# EAGLE schematic sanguish 3 (EAGLE 6.2)
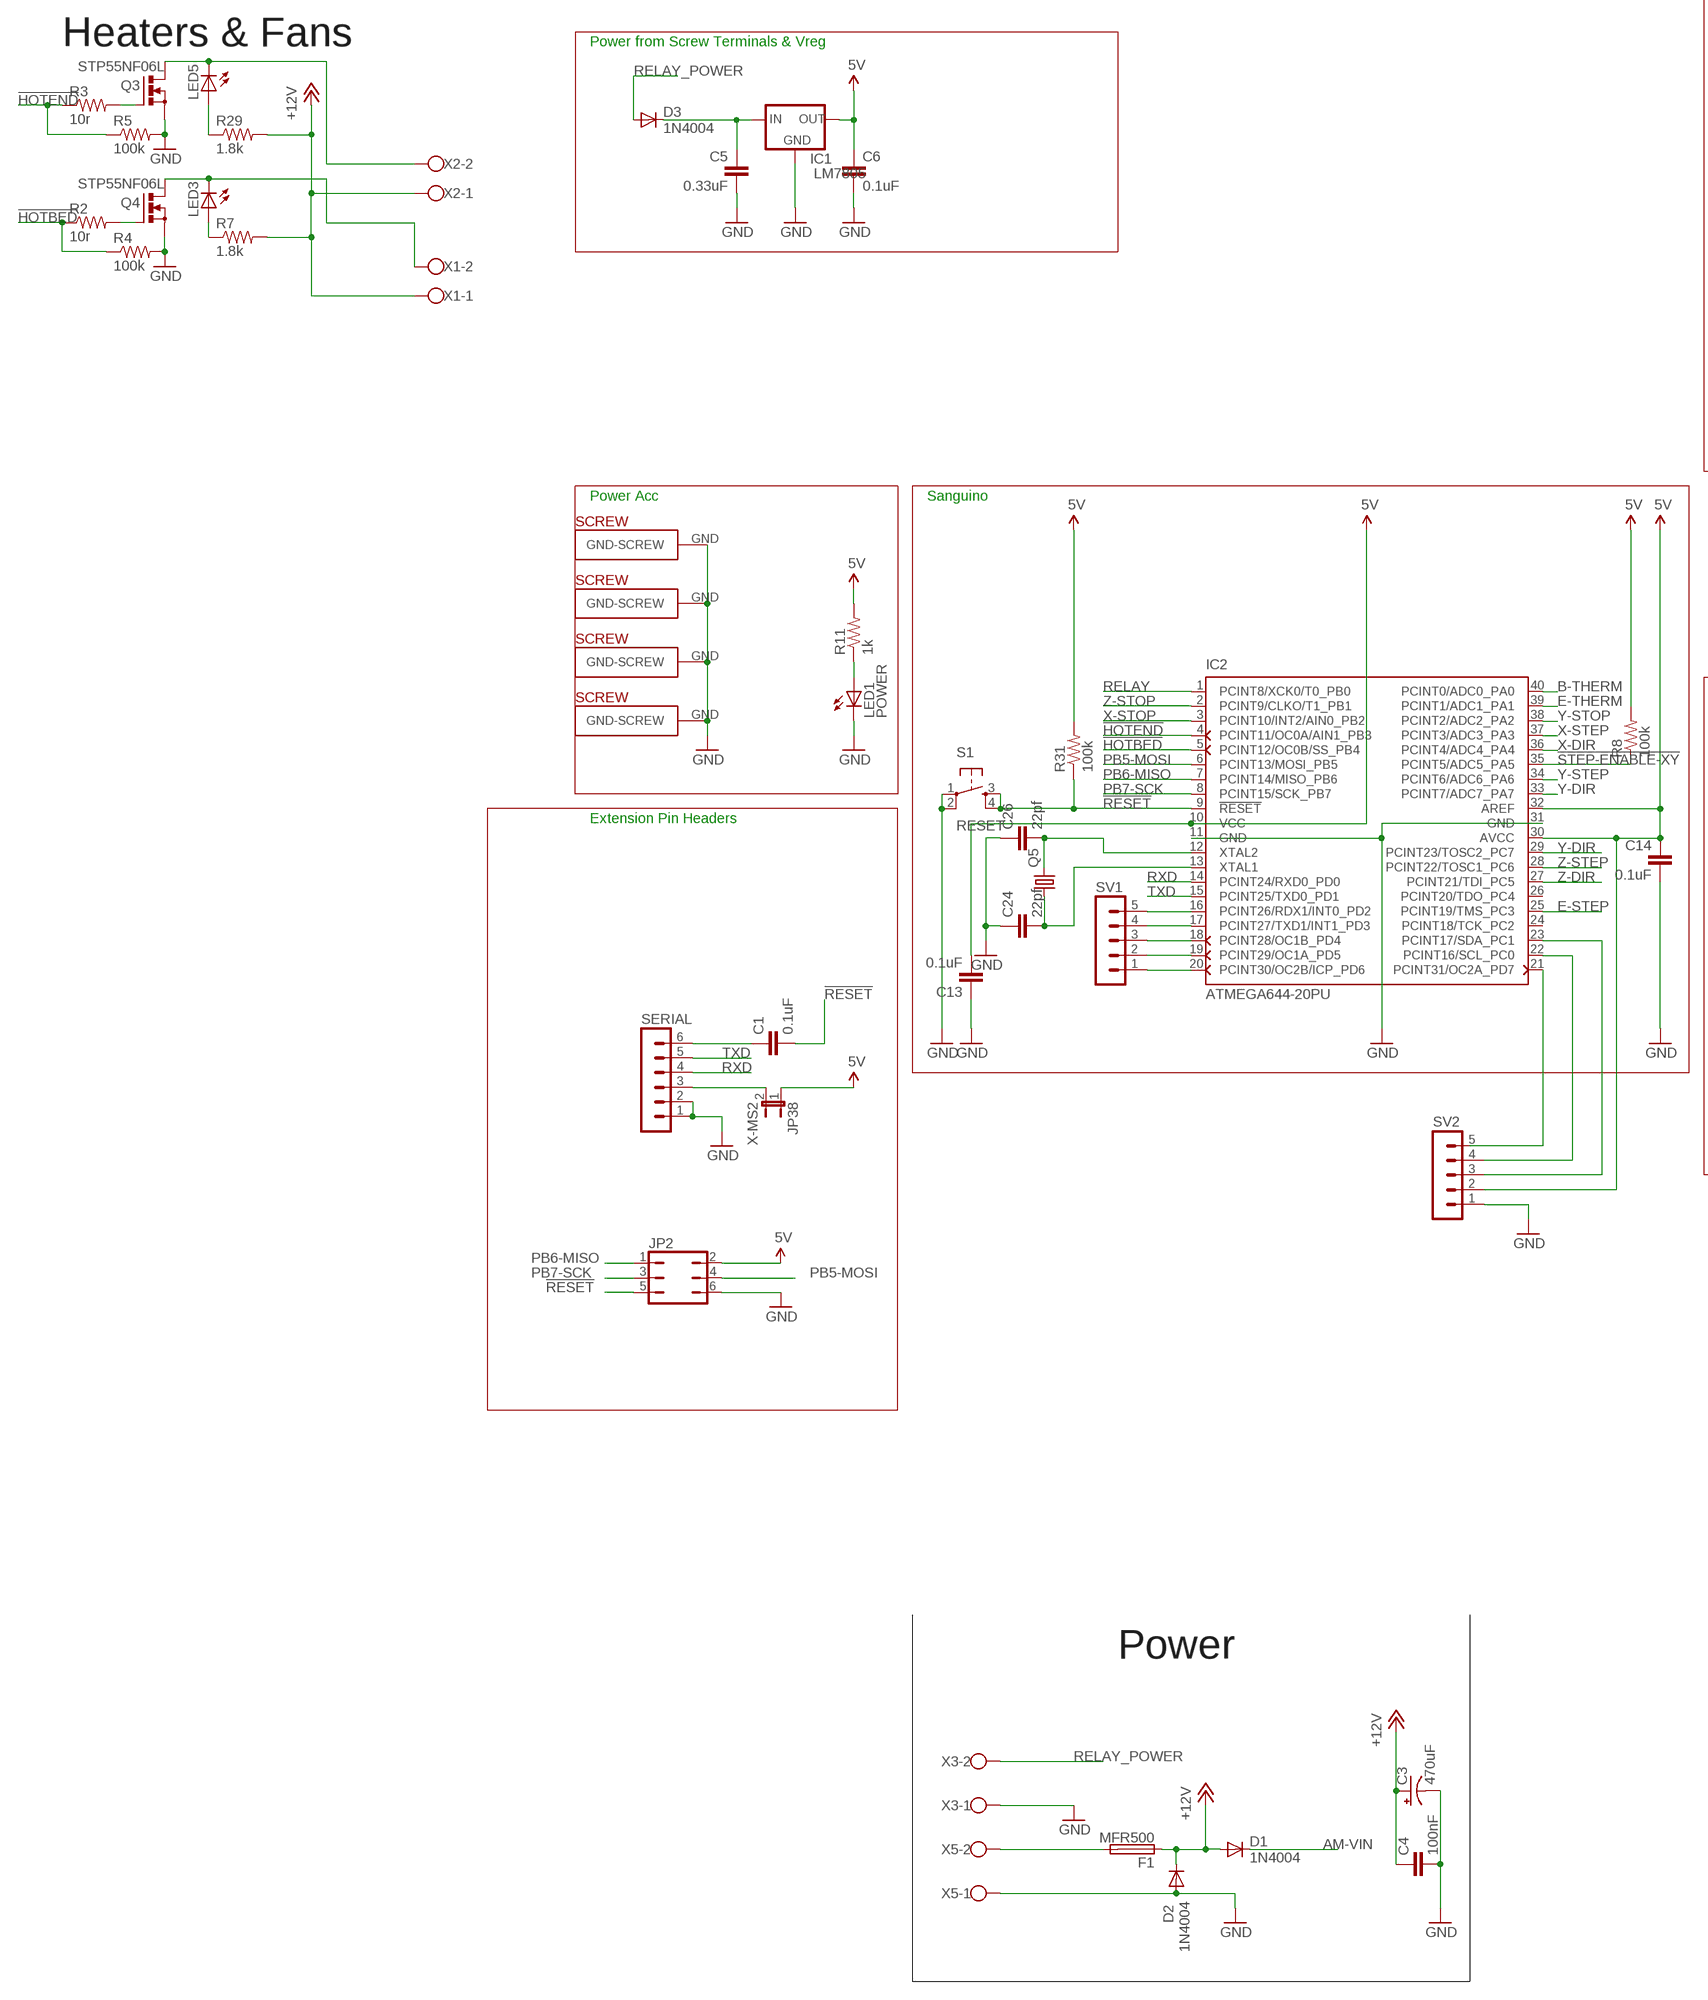
[diagram p0: schematic, sheet 1, part 1 of 2]
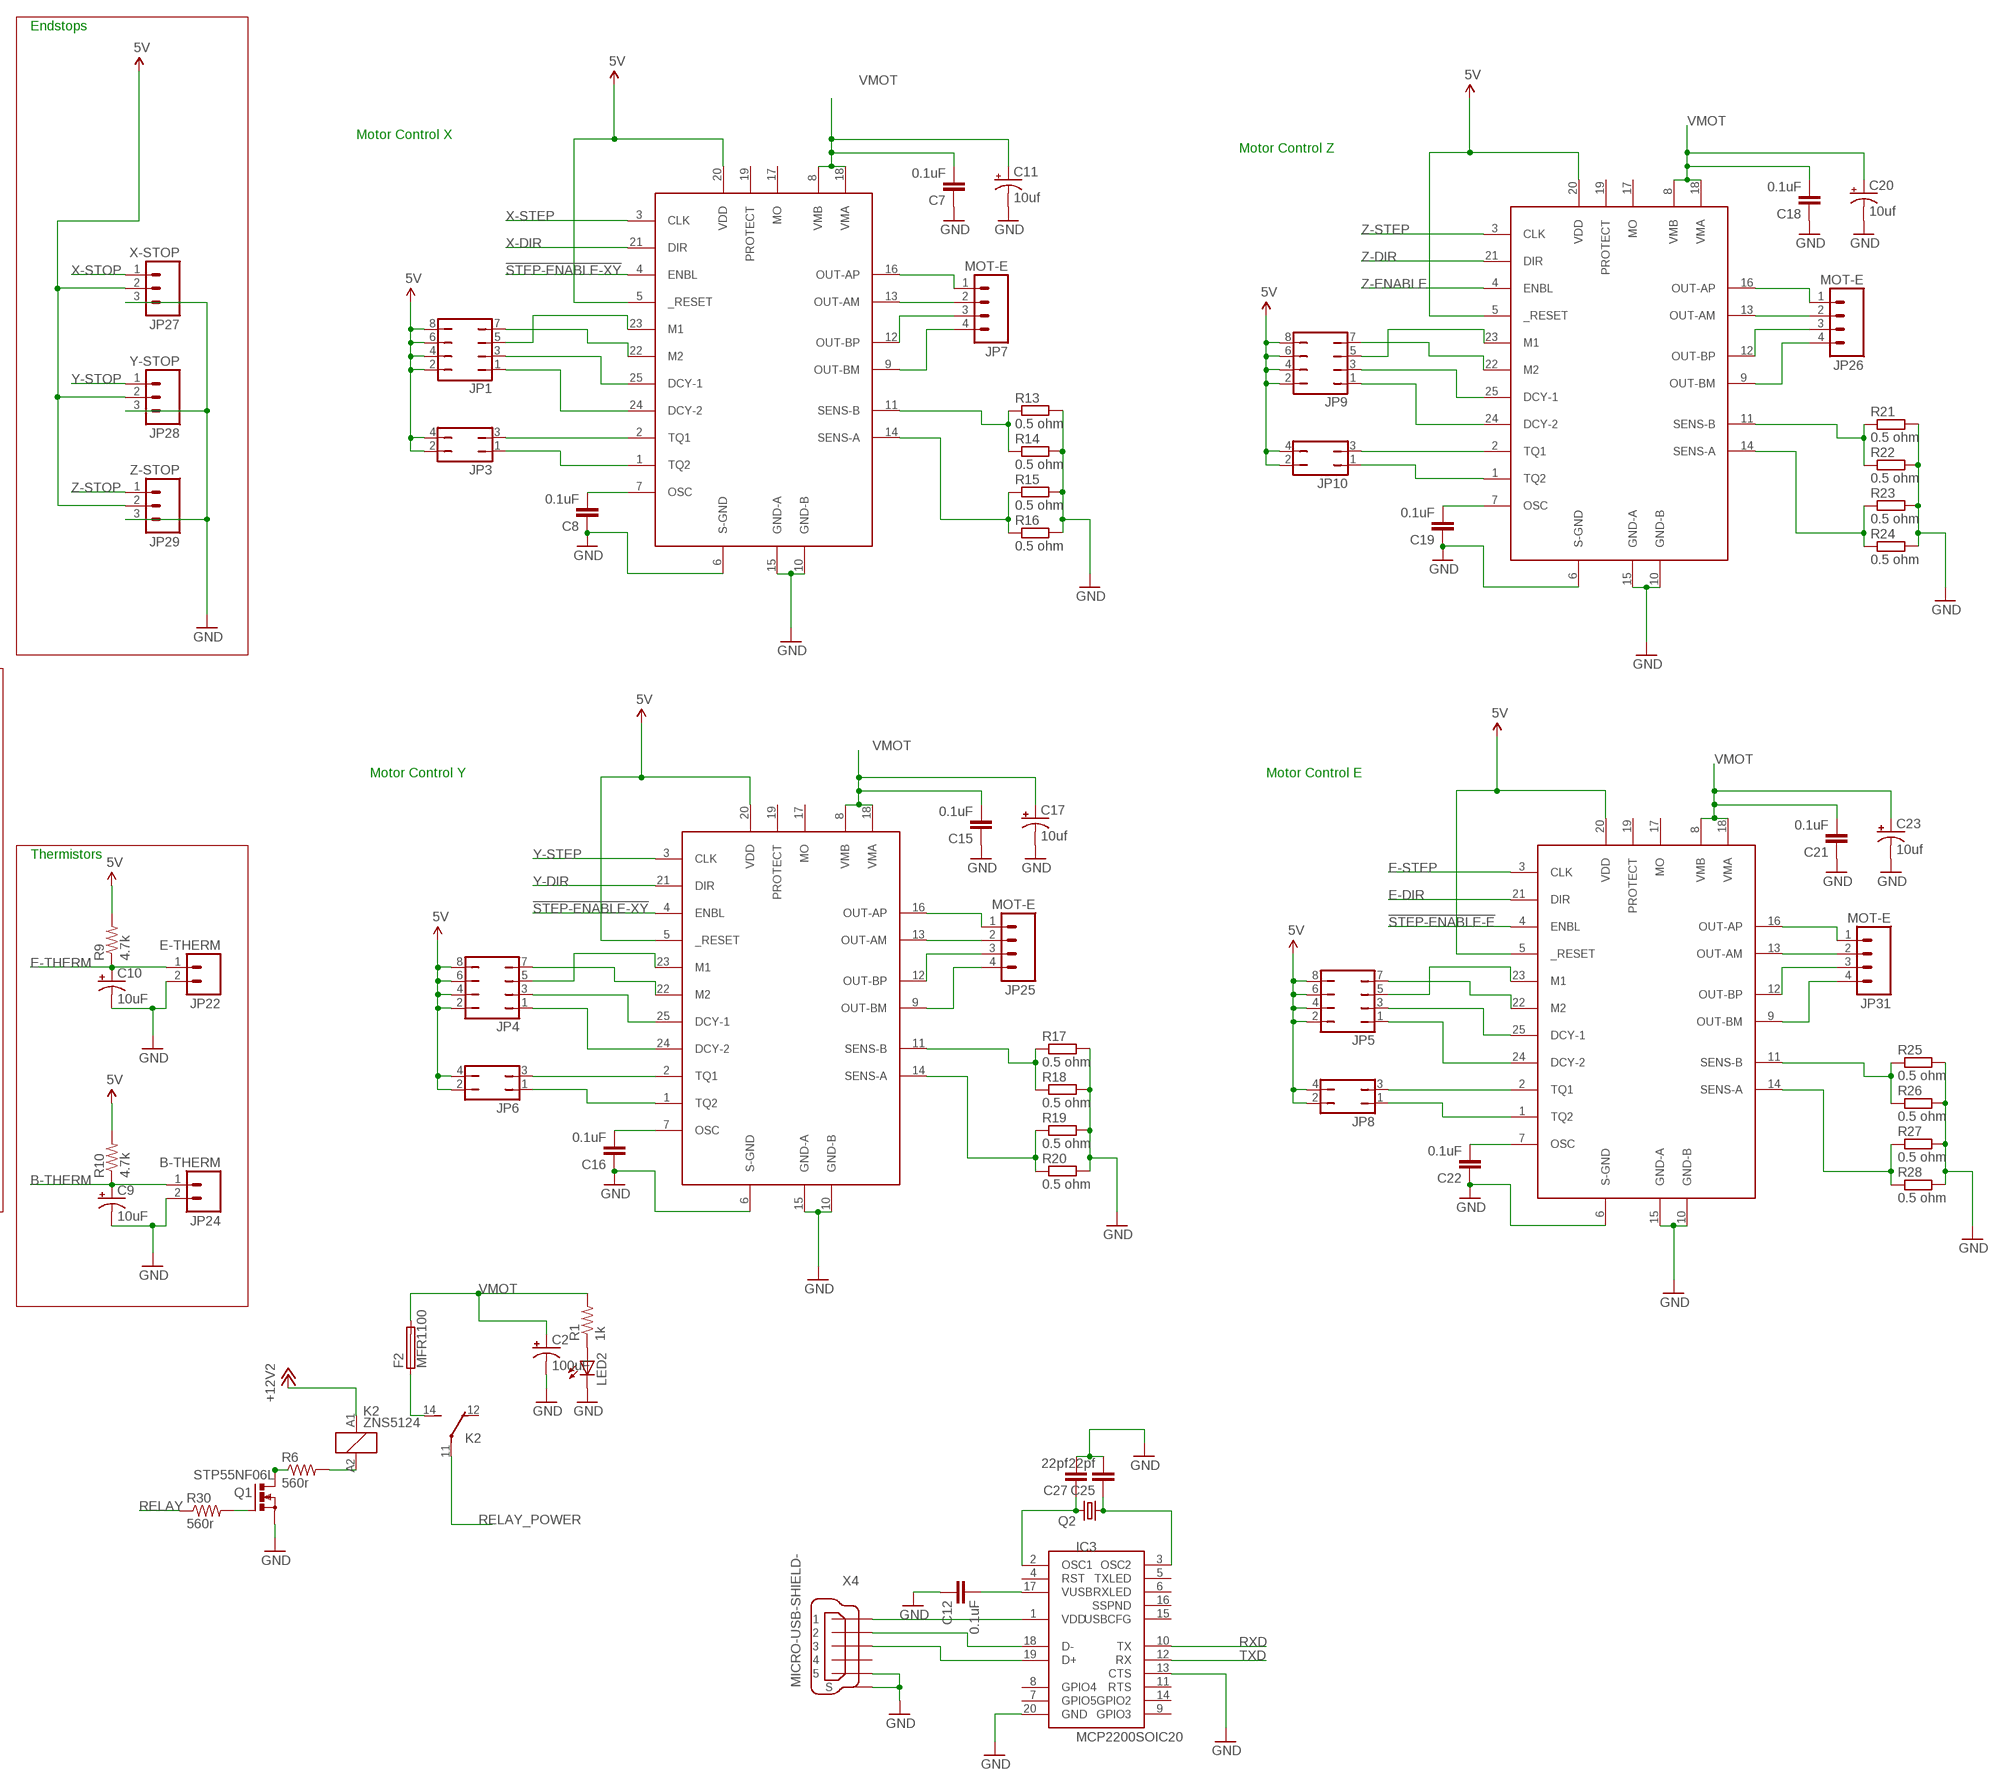
[diagram p1: schematic, sheet 1, part 2 of 2]

## Parts
C1  0.1uF  CAPPTH2  [CAP-PTH-SMALL2]
C2  100uF  CAP_POLPTH2  [CPOL-RADIAL-10UF-25V]
C3  470uF  CPOL-USE3.5-8  [E3,5-8]
C4  100nF  C2,5-3  [C2.5-3]
C5  0.33uF  CAPPTH2  [CAP-PTH-SMALL2]
C6  0.1uF  CAPPTH2  [CAP-PTH-SMALL2]
C7  0.1uF  CAPPTH2  [CAP-PTH-SMALL2]
C8  0.1uF  CAPPTH2  [CAP-PTH-SMALL2]
C9  10uF  CAP_POLPTH2  [CPOL-RADIAL-10UF-25V]
C10  10uF  CAP_POLPTH2  [CPOL-RADIAL-10UF-25V]
C11  10uf  CAP_POLPTH1  [CPOL-RADIAL-100UF-25V]
C12  0.1uF  CAPPTH2  [CAP-PTH-SMALL2]
C13  0.1uF  CAPPTH2  [CAP-PTH-SMALL2]
C14  0.1uF  CAPPTH2  [CAP-PTH-SMALL2]
C15  0.1uF  CAPPTH2  [CAP-PTH-SMALL2]
C16  0.1uF  CAPPTH2  [CAP-PTH-SMALL2]
C17  10uf  CAP_POLPTH1  [CPOL-RADIAL-100UF-25V]
C18  0.1uF  CAPPTH2  [CAP-PTH-SMALL2]
C19  0.1uF  CAPPTH2  [CAP-PTH-SMALL2]
C20  10uf  CAP_POLPTH1  [CPOL-RADIAL-100UF-25V]
C21  0.1uF  CAPPTH2  [CAP-PTH-SMALL2]
C22  0.1uF  CAPPTH2  [CAP-PTH-SMALL2]
C23  10uf  CAP_POLPTH1  [CPOL-RADIAL-100UF-25V]
C24  22pf  CAPPTH2  [CAP-PTH-SMALL2]
C25  22pf  CAPPTH2  [CAP-PTH-SMALL2]
C26  22pf  CAPPTH2  [CAP-PTH-SMALL2]
C27  22pf  CAPPTH2  [CAP-PTH-SMALL2]
D1  1N4004  [DO41-10]
D2  1N4004  [DO41-10]
D3  1N4004  [DO41-10]
F1  MFR500  PTCFUSE  [MFR500]
F2  MFR1100  PTCFUSEMFR1100  [MFR1100]
IC1  LM7805  V_REG_78XX  [78XXL-CUSTOM]
IC2  ATMEGA644-20PU  [DIL40]
IC3  MCP2200SOIC20  [SOIC20]
JP1  JP4Q  [JP4Q]
JP2  JP3Q  [JP3Q]
JP3  JP2Q  [JP2Q]
JP4  JP4Q  [JP4Q]
JP5  JP4Q  [JP4Q]
JP6  JP2Q  [JP2Q]
JP7  MOT-E  M04POLAR  [MOLEX-1X4]
JP8  JP2Q  [JP2Q]
JP9  JP4Q  [JP4Q]
JP10  JP2Q  [JP2Q]
JP22  E-THERM  M02PTH  [1X02]
JP24  B-THERM  M02PTH  [1X02]
JP25  MOT-E  M04POLAR  [MOLEX-1X4]
JP26  MOT-E  M04POLAR  [MOLEX-1X4]
JP27  X-STOP  M03POLAR  [MOLEX-1X3]
JP28  Y-STOP  M03POLAR  [MOLEX-1X3]
JP29  Z-STOP  M03POLAR  [MOLEX-1X3]
JP31  MOT-E  M04POLAR  [MOLEX-1X4]
JP38  X-MS2  JUMPER-2PTH  [1X02]
K2  ZNS5124  [ZN5]
LED1  POWER  LED3MM  [LED3MM]
LED2  LED3MM  [LED3MM]
LED3  LED3MM  [LED3MM]
LED5  LED3MM  [LED3MM]
Q1  STP55NF06L  IRF512  [TO220BV]
Q2  CRYSTALHC49S  [HC49/S]
Q3  STP55NF06L  IRF512  [TO220BV]
Q4  STP55NF06L  IRF512  [TO220BV]
Q5  CRYSTALHC49S  [HC49/S]
R1  1k  R-US_0207/2V  [0207/2V]
R2  10r  R-US_0207/2V  [0207/2V]
R3  10r  R-US_0207/2V  [0207/2V]
R4  100k  R-US_0207/2V  [0207/2V]
R5  100k  R-US_0207/2V  [0207/2V]
R6  560r  R-US_0207/2V  [0207/2V]
R7  1.8k  R-US_0207/2V  [0207/2V]
R8  100k  R-US_0207/2V  [0207/2V]
R9  4.7k  R-US_0207/2V  [0207/2V]
R10  4.7k  R-US_0207/2V  [0207/2V]
R11  1k  R-US_0207/2V  [0207/2V]
R13  0.5 ohm  R-EU_0207/10  [0207/10]
R14  0.5 ohm  R-EU_0207/10  [0207/10]
R15  0.5 ohm  R-EU_0207/10  [0207/10]
R16  0.5 ohm  R-EU_0207/10  [0207/10]
R17  0.5 ohm  R-EU_0207/10  [0207/10]
R18  0.5 ohm  R-EU_0207/10  [0207/10]
R19  0.5 ohm  R-EU_0207/10  [0207/10]
R20  0.5 ohm  R-EU_0207/10  [0207/10]
R21  0.5 ohm  R-EU_0207/10  [0207/10]
R22  0.5 ohm  R-EU_0207/10  [0207/10]
R23  0.5 ohm  R-EU_0207/10  [0207/10]
R24  0.5 ohm  R-EU_0207/10  [0207/10]
R25  0.5 ohm  R-EU_0207/10  [0207/10]
R26  0.5 ohm  R-EU_0207/10  [0207/10]
R27  0.5 ohm  R-EU_0207/10  [0207/10]
R28  0.5 ohm  R-EU_0207/10  [0207/10]
R29  1.8k  R-US_0207/2V  [0207/2V]
R30  560r  R-US_0207/2V  [0207/2V]
R31  100k  R-US_0207/2V  [0207/2V]
S1  RESET  TAC_SWITCHPTH  [TACTILE-PTH]
SERIAL  MA06-1  [MA06-1]
SV1  MA05-1  [MA05-1]
SV2  MA05-1  [MA05-1]
U$7  PLATED-SCREW  [PLATEDSCREW]
U$17  PLATED-SCREW  [PLATEDSCREW]
U$21  TB6560  [ZIP25]
U$37  PLATED-SCREW  [PLATEDSCREW]
U$38  PLATED-SCREW  [PLATEDSCREW]
U$43  TB6560  [ZIP25]
U$46  TB6560  [ZIP25]
X1  W237-102  [W237-102]
X2  W237-102  [W237-102]
X3  W237-102  [W237-102]
X4  MICRO-USB-SHIELD-  [10118192-0001LF]
X5  W237-102  [W237-102]
XMOT  TB6560  [ZIP25]

## Nets
5V: C6.1 C13.2 C14.1 IC1.OUT IC2.10(VCC) IC2.30(AVCC) IC2.32(AREF) JP1.2 JP1.4 JP1.6 JP1.8 JP2.2 JP3.2 JP3.4 JP4.2 JP4.4 JP4.6 JP4.8 JP5.2 JP5.4 JP5.6 JP5.8 JP6.2 JP6.4 JP8.2 JP8.4 JP9.2 JP9.4 JP9.6 JP9.8 JP10.2 JP10.4 JP27.2 JP28.2 JP29.2 JP38.1 R8.2 R9.2 R10.2 R11.2 R31.2 SV2.2 U$21.5(_RESET) U$21.20(VDD) U$43.5(_RESET) U$43.20(VDD) U$46.5(_RESET) U$46.20(VDD) XMOT.5(_RESET) XMOT.20(VDD)
!HOTBED: IC2.5(PCINT12/OC0B/SS_PB4) R2.1 R4.1
!HOTEND: IC2.4(PCINT11/OC0A/AIN1_PB3) R3.1 R5.1
!RESET: C1.2 IC2.9(!RESET) JP2.5 R31.1 S1.3 S1.4
!STEP-ENABLE-E: U$46.4(ENBL)
!STEP-ENABLE-XY: IC2.35(PCINT5/ADC5_PA5) R8.1 U$21.4(ENBL) XMOT.4(ENBL)
+12V: C3.+ C4.1 D1.A D2.C F1.1 K2.A1 R7.2 R29.2 X1.1 X2.1 ; supply symbol labelled +12V2
AM-VIN: D1.C
B-THERM: C9.1(+) IC2.40(PCINT0/ADC0_PA0) JP24.1 R10.1
E-DIR: U$46.21(DIR)
E-STEP: IC2.25(PCINT19/TMS_PC3) U$46.3(CLK)
E-THERM: C10.1(+) IC2.39(PCINT1/ADC1_PA1) JP22.1 R9.1
GND [Power]: C2.2(-) C3.- C4.2 C5.2 C6.2 C7.1 C8.1 C9.2(-) C10.2(-) C11.2(-) C12.1 C13.1 C14.2 C15.1 C16.1 C17.2(-) C18.1 C19.1 C20.2(-) C21.1 C22.1 C23.2(-) C24.1 C25.2 C26.1 C27.2 D2.A IC1.GND IC2.11(GND) IC2.31(GND) IC3.13(CTS) IC3.20(GND) JP2.6 JP22.2 JP24.2 JP27.3 JP28.3 JP29.3 LED1.K(C) LED2.K(C) Q1.S Q3.S Q4.S R4.2 R5.2 R13.2 R14.2 R15.2 R16.2 R17.2 R18.2 R19.2 R20.2 R21.2 R22.2 R23.2 R24.2 R25.2 R26.2 R27.2 R28.2 S1.1 S1.2 SERIAL.1 SERIAL.2 SV2.1 U$7.GND(GND-SCREW) U$17.GND(GND-SCREW) U$21.6(S-GND) U$21.10(GND-B) U$21.15(GND-A) U$37.GND(GND-SCREW) U$38.GND(GND-SCREW) U$43.6(S-GND) U$43.10(GND-B) U$43.15(GND-A) U$46.6(S-GND) U$46.10(GND-B) U$46.15(GND-A) X3.1 X4.5 X4.M1(S) X4.M2(S) X4.M3(S) X4.M4(S) X4.M5(S) X4.M6(S) X5.1 XMOT.6(S-GND) XMOT.10(GND-B) XMOT.15(GND-A)
LED1: LED1.A R11.1
N$1: JP7.1 XMOT.16(OUT-AP)
N$2: JP25.1 U$21.16(OUT-AP)
N$3: JP7.2 XMOT.13(OUT-AM)
N$4: JP7.3 XMOT.12(OUT-BP)
N$5: JP7.4 XMOT.9(OUT-BM)
N$6: JP5.7 U$46.22(M2)
N$7: JP1.7 XMOT.22(M2)
N$8: JP1.3 XMOT.25(DCY-1)
N$9: JP1.1 XMOT.24(DCY-2)
N$10: JP10.3 U$43.2(TQ1)
N$11: JP3.1 XMOT.1(TQ2)
N$12: JP5.5 U$46.23(M1)
N$13: JP25.2 U$21.13(OUT-AM)
N$14: JP25.3 U$21.12(OUT-BP)
N$15: R13.1 R14.1 XMOT.11(SENS-B)
N$16: R15.1 R16.1 XMOT.14(SENS-A)
N$17: JP25.4 U$21.9(OUT-BM)
N$18: JP9.7 U$43.22(M2)
N$19: C8.2 XMOT.7(OSC)
N$20: JP4.7 U$21.22(M2)
N$21: JP4.3 U$21.25(DCY-1)
N$22: JP4.1 U$21.24(DCY-2)
N$23: JP9.5 U$43.23(M1)
N$24: JP8.3 U$46.2(TQ1)
N$25: JP5.3 U$46.25(DCY-1)
N$26: R17.1 R18.1 U$21.11(SENS-B)
N$27: R19.1 R20.1 U$21.14(SENS-A)
N$28: C16.2 U$21.7(OSC)
N$29: JP26.1 U$43.16(OUT-AP)
N$30: JP26.2 U$43.13(OUT-AM)
N$31: JP26.3 U$43.12(OUT-BP)
N$32: JP26.4 U$43.9(OUT-BM)
N$33: JP5.1 U$46.24(DCY-2)
N$34: JP6.3 U$21.2(TQ1)
N$35: JP8.1 U$46.1(TQ2)
N$36: JP3.3 XMOT.2(TQ1)
N$37: JP4.5 U$21.23(M1)
N$38: JP1.5 XMOT.23(M1)
N$39: JP9.3 U$43.25(DCY-1)
N$40: R21.1 R22.1 U$43.11(SENS-B)
N$41: R23.1 R24.1 U$43.14(SENS-A)
N$42: C19.2 U$43.7(OSC)
N$43: JP31.1 U$46.16(OUT-AP)
N$44: JP31.2 U$46.13(OUT-AM)
N$45: JP31.3 U$46.12(OUT-BP)
N$46: JP31.4 U$46.9(OUT-BM)
N$47: JP9.1
N$48: LED2.A R1.1
N$49: JP10.1
N$50: IC2.16(PCINT26/RDX1/INT0_PD2) SV1.5
N$51: IC2.17(PCINT27/TXD1/INT1_PD3) SV1.4
N$52: IC2.18(PCINT28/OC1B_PD4) SV1.3
N$53: IC2.19(PCINT29/OC1A_PD5) SV1.2
N$54: R25.1 R26.1 U$46.11(SENS-B)
N$55: R27.1 R28.1 U$46.14(SENS-A)
N$56: C22.2 U$46.7(OSC)
N$57: LED3.K(C) Q4.D X1.2
N$58: IC2.20(PCINT30/OC2B/ICP_PD6) SV1.1
N$59: LED5.K(C) Q3.D X2.2
N$60: Q4.G R2.2
N$61: Q3.G R3.2
N$62: IC2.21(PCINT31/OC2A_PD7)
N$63: IC2.22(PCINT16/SCL_PC0) SV2.4
N$64: LED3.A R7.1
N$65: LED5.A R29.1
N$66: Q1.D R6.1
N$67: Q1.G R30.2
N$68: C5.1 D3.C IC1.IN
N$69: IC2.23(PCINT17/SDA_PC1) SV2.3
N$70: C1.1 SERIAL.6
N$71: JP38.2 SERIAL.3
N$72: F2.1 K2.14(2:S)
N$73: K2.A2 R6.2
N$74: F1.2 X5.2
N$75: C12.2 IC3.17(VUSB)
N$76: JP6.1 U$21.1(TQ2)
N$77: IC3.1(VDD) X4.1
N$78: IC3.18(D-) X4.2
N$79: IC3.19(D+) X4.3
N$80: C26.2 IC2.12(XTAL2) Q5.2
N$81: C24.2 IC2.13(XTAL1) Q5.1
N$82: C27.1 IC3.2(OSC1) Q2.2
N$83: C25.1 IC3.3(OSC2) Q2.1
PB5-MOSI: IC2.6(PCINT13/MOSI_PB5) JP2.4
PB6-MISO: IC2.7(PCINT14/MISO_PB6) JP2.1
PB7-SCK: IC2.8(PCINT15/SCK_PB7) JP2.3
RELAY: IC2.1(PCINT8/XCK0/T0_PB0) R30.1
RELAY_POWER: D3.A K2.11(2:P) X3.2
RXD: IC2.14(PCINT24/RXD0_PD0) IC3.10(TX) SERIAL.4
TXD: IC2.15(PCINT25/TXD0_PD1) IC3.12(RX) SERIAL.5
VMOT: C2.1(+) C7.2 C11.1(+) C15.2 C17.1(+) C18.2 C20.1(+) C21.2 C23.1(+) F2.2 R1.2 U$21.8(VMB) U$21.18(VMA) U$43.8(VMB) U$43.18(VMA) U$46.8(VMB) U$46.18(VMA) XMOT.8(VMB) XMOT.18(VMA)
X-DIR: IC2.36(PCINT4/ADC4_PA4) XMOT.21(DIR)
X-STEP: IC2.37(PCINT3/ADC3_PA3) XMOT.3(CLK)
X-STOP: IC2.3(PCINT10/INT2/AIN0_PB2) JP27.1
Y-DIR: IC2.29(PCINT23/TOSC2_PC7) IC2.33(PCINT7/ADC7_PA7) U$21.21(DIR)
Y-STEP: IC2.34(PCINT6/ADC6_PA6) U$21.3(CLK)
Y-STOP: IC2.38(PCINT2/ADC2_PA2) JP28.1
Z-DIR: IC2.27(PCINT21/TDI_PC5) U$43.21(DIR)
Z-ENABLE: U$43.4(ENBL)
Z-STEP: IC2.28(PCINT22/TOSC1_PC6) U$43.3(CLK)
Z-STOP: IC2.2(PCINT9/CLKO/T1_PB1) JP29.1
Unconnected: IC2.24(PCINT18/TCK_PC2) IC2.26(PCINT20/TDO_PC4) IC3.4(RST) IC3.5(TXLED) IC3.6(RXLED) IC3.7(GPIO5) IC3.8(GPIO4) IC3.9(GPIO3) IC3.11(RTS) IC3.14(GPIO2) IC3.15(USBCFG) IC3.16(SSPND) K2.12(2:O) SV2.5 U$21.17(MO) U$21.19(PROTECT) U$43.1(TQ2) U$43.17(MO) U$43.19(PROTECT) U$43.24(DCY-2) U$46.17(MO) U$46.19(PROTECT) X4.4 XMOT.17(MO) XMOT.19(PROTECT)

## Notes on the sheet
- Endstops
- Motor Control X
- Motor Control Z
- Heaters & Fans | Power from Screw Terminals & Vreg
- Power Acc | Sanguino
- Motor Control Y | Motor Control E
- Thermistors
- Extension Pin Headers
- Power

## Library data of the parts
C1 C5-C8 C12-C16 C18 C19 C21 C22 C24-C27 = SparkFun:CAP: Capacitor Standard 0603 ceramic capacitor, and 0.1" leaded capacitor.
C2 C9-C11 C17 C20 C23 = SparkFun:CAP_POL: Capacitor Polarized These are standard SMD and PTH capacitors. Normally 10uF, 47uF, and 100uF in electrolytic and tantalum varieties. Always verify the external diameter of the through hole cap, it varies with capacity, voltage, and manufacturer. The EIA devices should be standard.
C3 = adafruit:CPOL-US: POLARIZED CAPACITOR, American symbol
C4 = capacitor-wima:C: CAPACITOR naming: grid - package width
D1-D3 = diode:1N4004: DIODE general purpose rectifier, 1 A
F1 F2 = RepRapjr:PTCFUSE: LITTLEFUSE Picofuse/slow Littlefuse
IC1 = SparkFun:V_REG_78XX: Voltage Regulator Standard 7805 5V regulator. IGO (Input Ground Output). Spark Fun Electronics SKU : COM-00107
IC2 = atmel:ATMEGA644-*PU: 8-bit Microcontroller with 64K Bytes In-System Programmable Flash Auto generated by make-symbol-device-package-bsdl.ulp Rev. 34 Source: http://www.atmel.com/dyn/resources/prod_documents/doc2593.pdf; MPN: ATMEGA644-20PU; OC_FARNELL: 1288340; OC_NEWARK: 23M5060
IC3 = microchip-update-2:MCP2200: USB 2.0 to UART Protocol Converter with GPIO
JP1 JP4 JP5 JP9 = jumper:JP4Q: JUMPER
JP2 = jumper:JP3Q: JUMPER
JP3 JP6 JP8 JP10 = jumper:JP2Q: JUMPER
JP7 JP25 JP26 JP31 = SparkFun:M04: Header 4 Standard 4-pin 0.1" header. Use with straight break away headers (SKU : PRT-00116), right angle break away headers (PRT-00553), swiss pins (PRT-00743), machine pins (PRT-00117), and female headers (PRT-00115). Molex polarized connector foot print use with SKU : PRT-08231 with associated crimp pins and housings.
JP22 JP24 = SparkFun:M02: Header 2 Standard 2-pin 0.1" header. Use with straight break away headers (SKU : PRT-00116), right angle break away headers (PRT-00553), swiss pins (PRT-00743), machine pins (PRT-00117), and female headers (PRT-00115). Molex polarized connector foot print use with SKU : PRT-08233 with associated crimp pins and housings.
JP27-JP29 = SparkFun:M03: Header 3 Standard 3-pin 0.1" header. Use with straight break away headers (SKU : PRT-00116), right angle break away headers (PRT-00553), swiss pins (PRT-00743), machine pins (PRT-00117), and female headers (PRT-00115). Molex polarized connector foot print use with SKU : PRT-08232 with associated crimp pins and housings.
JP38 = SparkFun:JUMPER-2: Jumper Basic 0.1" spaced jumper. Use with breakaway headers.
K2 = relay:ZNS5*: Miniature Power PCB Relay SCHRACK 1pole 10 A Source: http://www.schrack.com/.. 5847.pdf; OC_FARNELL: unknown; OC_NEWARK: unknown
LED1 = SparkFun:LED: LEDs Standard schematic elements and footprints for 5mm, 3mm, 1206, and 0603 sized LEDs. 5mm - Spark Fun Electronics SKU : COM-00529 (and others)
LED2 LED3 LED5 = led:LED: LED OSRAM: - CHIPLED LG R971, LG N971, LY N971, LG Q971, LY Q971, LO R971, LY R971 LH N974, LH R974 LS Q976, LO Q976, LY Q976 LO Q996 - Hyper CHIPLED LW Q18S LB Q993, LB Q99A, LB R99A - SideLED LS A670, LO A670, LY A670, LG A670, LP A670 LB A673, LV A673, LT A673, LW A673 LH A674 LY A675 LS A676, LA A676, LO A676, LY A676, LW A676 LS A679, LY A679, LG A679 - Hyper Micro SIDELED® LS Y876, LA Y876, LO Y876, LY Y876 LT Y87S - SmartLED LW L88C, LW L88S LB L89C, LB L89S, LG L890 LS L89K, LO L89K, LY L89K LS L896, LA L896, LO L896, LY L896 - TOPLED LS T670, LO T670, LY T670, LG T670, LP T670 LSG T670, LSP T670, LSY T670, LOP T670, LYG T670 LG T671, LOG T671, LSG T671 LB T673, LV T673, LT T673, LW T673 LH T674 LS T676, LA T676, LO T676, LY T676, LB T676, LH T676, LSB T676, LW T676 LB T67C, LV T67C, LT T67C, LS T67K, LO T67K, LY T67K, LW E67C LS E67B, LA E67B, LO E67B, LY E67B, LB E67C, LV E67C, LT E67C LW T67C LS T679, LY T679, LG T679 LS T770, LO T770, LY T770, LG T770, LP T770 LB T773, LV T773, LT T773, LW T773 LH T774 LS E675, LA E675, LY E675, LS T675 LS T776, LA T776, LO T776, LY T776, LB T776 LHGB T686 LT T68C, LB T68C - Hyper Mini TOPLED® LB M676 - Mini TOPLED Santana® LG M470 LS M47K, LO M47K, LY M47K Source: http://www.osram.convergy.de LUXEON: - LUMILED® LXK2-PW12-R00, LXK2-PW12-S00, LXK2-PW14-U00, LXK2-PW14-V00 LXK2-PM12-R00, LXK2-PM12-S00, LXK2-PM14-U00 LXK2-PE12-Q00, LXK2-PE12-R00, LXK2-PE12-S00, LXK2-PE14-T00, LXK2-PE14-U00 LXK2-PB12-K00, LXK2-PB12-L00, LXK2-PB12-M00, LXK2-PB14-N00, LXK2-PB14-P00, LXK2-PB14-Q00 LXK2-PR12-L00, LXK2-PR12-M00, LXK2-PR14-Q00, LXK2-PR14-R00 LXK2-PD12-Q00, LXK2-PD12-R00, LXK2-PD12-S00 LXK2-PH12-R00, LXK2-PH12-S00 LXK2-PL12-P00, LXK2-PL12-Q00, LXK2-PL12-R00 Source: www.luxeon.com KINGBRIGHT: KA-3528ASYC Source: www.kingbright.com
Q1 Q3 Q4 = transistor-power:IRF512: N-CHANNEL MOS FET
Q2 Q5 = crystal:CRYSTAL: CRYSTAL; OC_FARNELL: 1667008; OC_NEWARK: unknown
R1-R11 R29-R31 = resistor:R-US_: RESISTOR, American symbol
R13-R28 = resistor:R-EU_: RESISTOR, European symbol
S1 = SparkFun:TAC_SWITCH: Momentary Switch Button commonly used for reset or general input. Spark Fun Electronics SKU : COM-00097
SERIAL = con-lstb:MA06-1: PIN HEADER; OC_FARNELL: unknown; OC_NEWARK: unknown
SV1 SV2 = con-lstb:MA05-1: PIN HEADER; OC_FARNELL: unknown; OC_NEWARK: unknown
U$7 U$17 U$37 U$38 = Sanguinololu:PLATED-SCREW
U$21 U$43 U$46 XMOT = tb6560:TB6560
X1-X3 X5 = con-wago-500:W237-102: WAGO SCREW CLAMP; MPN: 237-102; OC_FARNELL: unknown; OC_NEWARK: 70K9898
X4 = shinythings:MICRO-USB-SHIELD-: MINI USB Connector Source: http://www.hirose.co.jp/cataloge_hp/e24000019.pdf

## Net classes
0 default: width 0.178 mm, drill 0.406 mm, clearance 0.178 mm
1 Power: width 0.3 mm, drill 0.406 mm, clearance 0.178 mm